# EAGLE design powermeter (EAGLE 6.6.0)
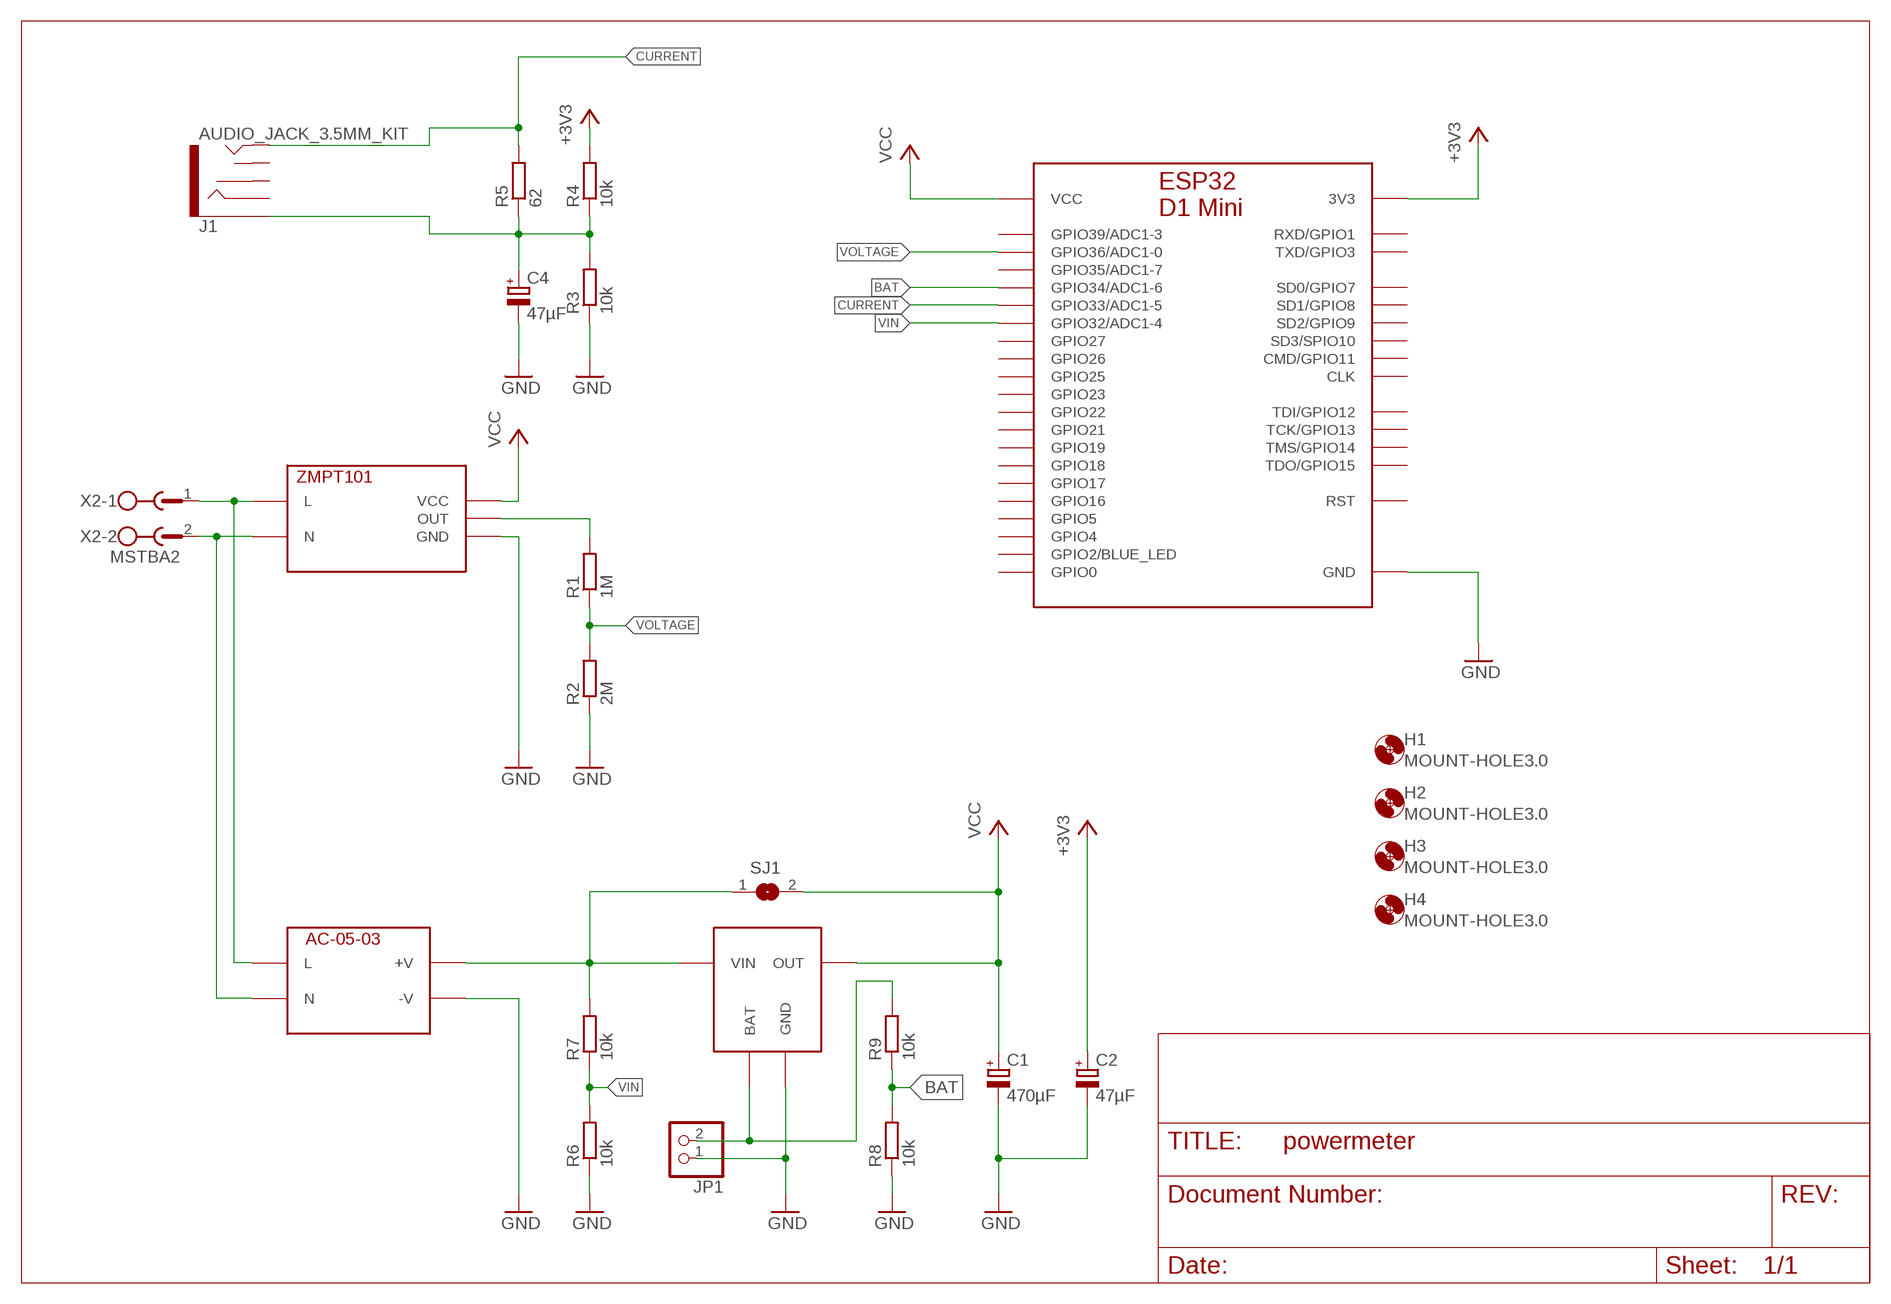
[diagram p0: schematic, sheet 1]

## Parts
C1  470µF  CPOL-EUE5-8.5  [E5-8,5]
C2  47µF  CPOL-EUE2.5-5  [E2,5-5]
C4  47µF  CPOL-EUE2.5-5  [E2,5-5]
H1  MOUNT-HOLE3.0  [3,0]
H2  MOUNT-HOLE3.0  [3,0]
H3  MOUNT-HOLE3.0  [3,0]
H4  MOUNT-HOLE3.0  [3,0]
J1  AUDIO_JACK_3.5MM_KIT  [AUDIO-JACK-KIT]
JP1  PINHD-1X2  [1X02]
R1  1M  R-EU_0204/7  [0204/7]
R2  2M  R-EU_0204/7  [0204/7]
R3  10k  R-EU_0204/7  [0204/7]
R4  10k  R-EU_0204/7  [0204/7]
R5  62  R-EU_0204/7  [0204/7]
R6  10k  R-EU_0204/7  [0204/7]
R7  10k  R-EU_0204/7  [0204/7]
R8  10k  R-EU_0204/7  [0204/7]
R9  10k  R-EU_0204/7  [0204/7]
SJ1  SJ  [SJ]
U1  ESP32D1MINI  [ESP32D1MINI]
U$1  ZMPT101  [ZMPT101]
U$2  AC-05-03  [AC-05-03]
U$3  MINI-UPS-S  [MINI-UPS-S]
X2  MSTBA2  [MSTBA2]

## Nets
+3V3 [power]: C2.+ R4.2 U1.3V3
BAT: R8.2 R9.1 U1.IO34(GPIO34/ADC1-6)
CURRENT: J1.TIP R5.2 U1.IO33(GPIO33/ADC1-5)
GND [power]: C1.- C2.- C4.- JP1.1 R2.1 R3.1 R6.1 R8.1 U1.GND1(GND) U1.GND2(GND) U1.GND3(GND) U$1.P$3(GND) U$1.P$4(GND) U$2.-V U$3.P$1(GND) U$3.P$3(GND) U$3.P$4(GND)
N$1: R1.2 U$1.OUT
N$2 [230v]: U$1.L U$2.L X2.1
N$3: C4.+ J1.SLEEVE R3.2 R4.1 R5.1
N$4 [230v]: U$1.N U$2.N X2.2
N$5: R7.2 SJ1.1 U$2.+V U$3.VIN
N$6: JP1.2 R9.2 U$3.BAT
VCC [power]: C1.+ SJ1.2 U1.VCC U$1.VCC U$3.OUT
VIN: R6.2 R7.1 U1.IO32(GPIO32/ADC1-4)
VOLTAGE: R1.1 R2.2 U1.IO36(GPIO36/ADC1-0)
Unconnected: J1.RING J1.RSH J1.TSH U1.CLK U1.CMD(CMD/GPIO11) U1.IO0(GPIO0) U1.IO2(GPIO2/BLUE_LED) U1.IO4(GPIO4) U1.IO5(GPIO5) U1.IO16(GPIO16) U1.IO17(GPIO17) U1.IO18(GPIO18) U1.IO19(GPIO19) U1.IO21(GPIO21) U1.IO22(GPIO22) U1.IO23(GPIO23) U1.IO25(GPIO25) U1.IO26(GPIO26) U1.IO27(GPIO27) U1.IO35(GPIO35/ADC1-7) U1.IO39(GPIO39/ADC1-3) U1.RST U1.RXD(RXD/GPIO1) U1.SD0(SD0/GPIO7) U1.SD1(SD1/GPIO8) U1.SD2(SD2/GPIO9) U1.SD3(SD3/SPIO10) U1.TCK(TCK/GPIO13) U1.TDI(TDI/GPIO12) U1.TDO(TDO/GPIO15) U1.TMS(TMS/GPIO14) U1.TXD(TXD/GPIO3)

## Library data of the parts
C1 C2 C4 = rcl:CPOL-EU: POLARIZED CAPACITOR, European symbol
H1-H4 = holes:MOUNT-HOLE: MOUNTING HOLE with drill center marker
J1 = SparkFun-Connectors:AUDIO_JACK_3.5MM: Audio Jack 3.5mm variants of PTH and SMT stereo audio jack with bypass switches. SparkFun Products: SparkFun SparkPunk Sound Kit <[https://www.sparkfun.com/products/11177]> - PTH MP3 Trigger <https://www.sparkfun.com/products/13720> -3.5mm SMD SparkFun PicoBoard <https://www.sparkfun.com/products/11888>- 2.5mm SMD; PROD_ID: CONN-08774; SF_ID: PRT-08032
JP1 = pinhead:PINHD-1X2: PIN HEADER
R1-R9 = rcl:R-EU_: RESISTOR, European symbol
SJ1 = jumper:SJ: SMD solder JUMPER
U1 = esp32-d1-mini:ESP32D1MINI
U$1 = ZMPT101:ZMPT101
U$2 = AC-05-03:AC-05-03
U$3 = mini-ups:MINI-UPS-S
X2 = con-phoenix-508:MSTBA2: PHOENIX; MF: FARNELL; MPN: 1757242; OC_FARNELL: 3705171; OC_NEWARK: 71C4161

## Net classes
0 default: width 0.305 mm, clearance 0.159 mm
1 power: width 0.61 mm, clearance 0.318 mm
2 230v: width 1.422 mm, clearance 1.676 mm

## Board
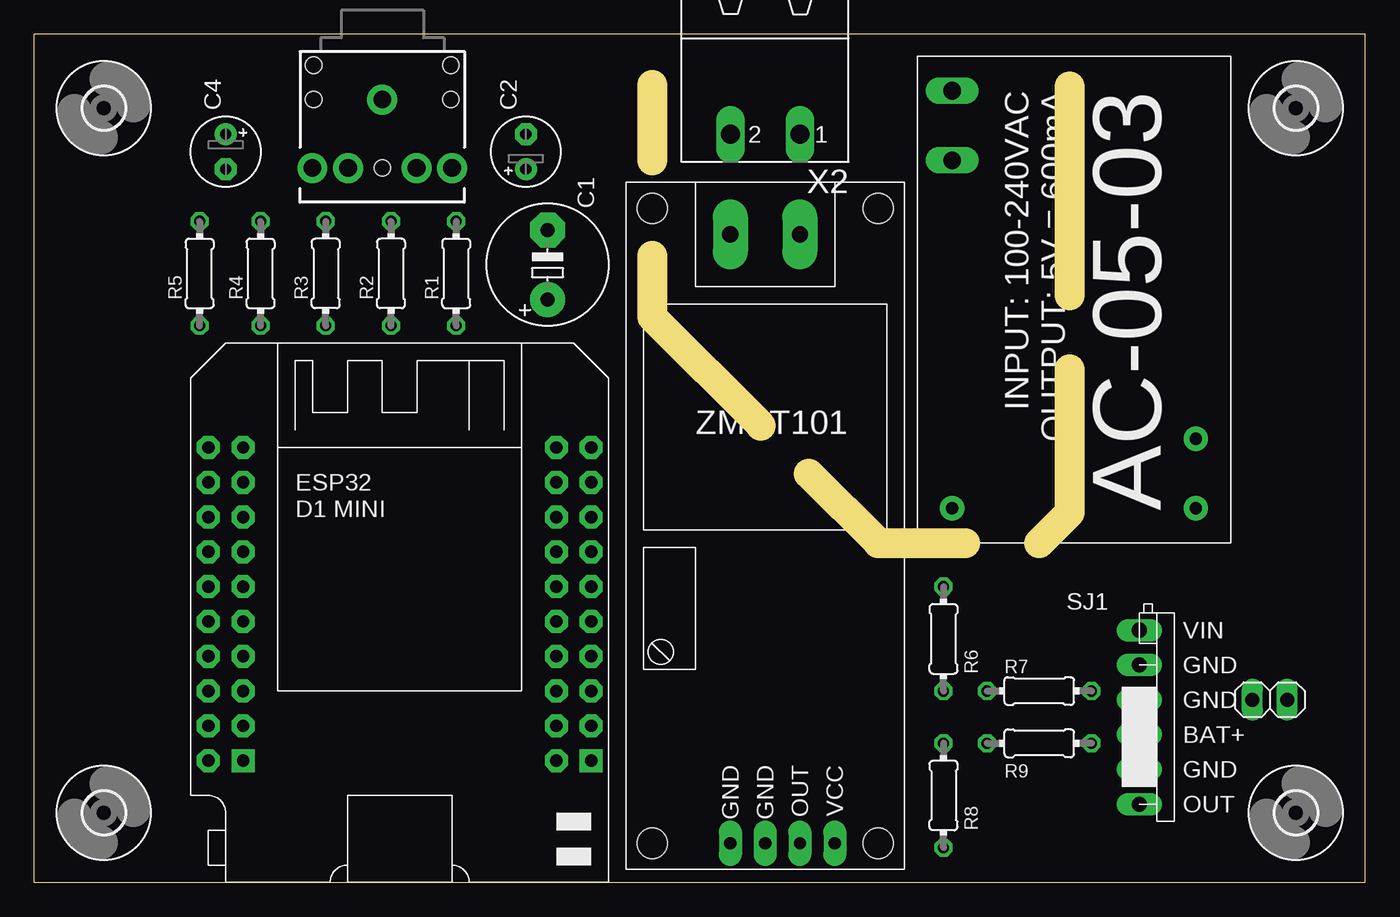
[diagram p1: board, top side]
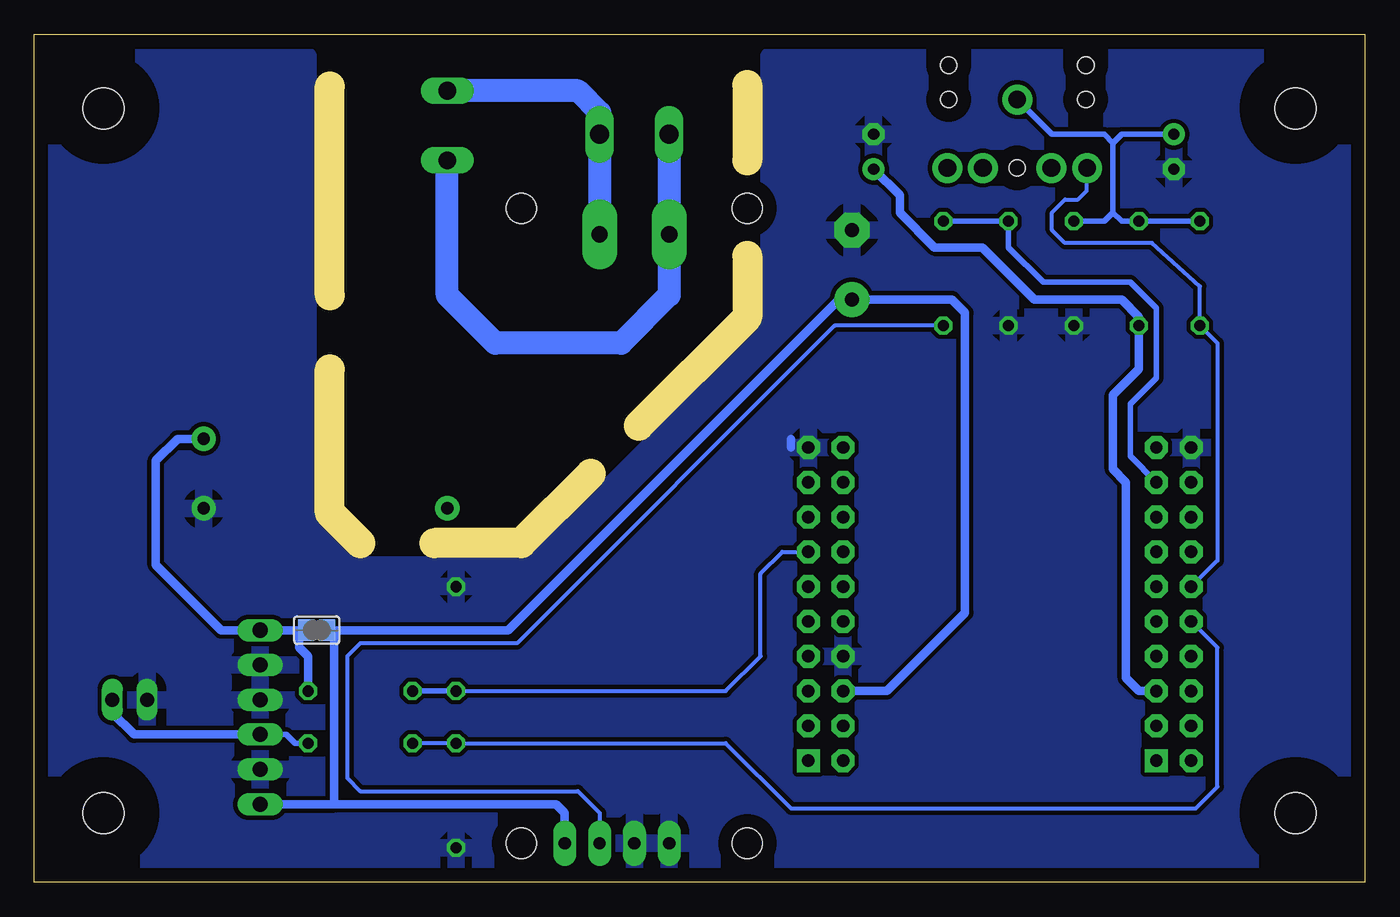
[diagram p2: board, bottom side, seen from below]

Size 97.14 x 61.91 mm. Coordinates in mm from the lower left corner, seen from the top.
Outline: 0,0 97.14,0 97.14,61.9 27.94,61.91 0.32,61.91 0,61.9 0,0
Copper layers (1*16): Top 0.035mm / dielectric 1.5mm / Bottom 0.035mm
Design rules "default *": minimum track width 10mil, minimum drill 24mil, track to track 8mil, track to pad 8mil, pad to pad 8mil, via to via 8mil, smd to smd 8mil, copper to edge 40mil, drill to drill 8mil, minimum pad ring 10mil, minimum via ring 8mil, stop-mask expansion 4mil, vias tented up to drill 0mil, thermal gap 25mil
Milling: 8 lines

### Footprints (pad centres in the part's own frame; a part is rotated, then mirrored left to right if it is on the bottom)
E5-8,5 = drill 1.016 pad 2.54: + -2.54,0 | drill 1.016 pad 2.54 octagon: - 2.54,0
E2,5-5 = drill 0.813 pad 1.6: + -1.27,0 | drill 0.813 pad 1.6 octagon: - 1.27,0
3,0 = hole 3: 0,0
AUDIO-JACK-KIT = drill 1.3 pad 2.184: RING 5,5.1; RSH 5,2.5; SLEEVE 0,0; TIP 5,-5.1; TSH 5,-2.5 | hole 1.2: 0,5; -2.5,5; -2.5,-5; 0,-5; 5,0
1X02 = drill 1.016 long: 1 -1.27,0; 2 1.27,0
0204/7 = drill 0.813 octagon: 1 -3.81,0; 2 3.81,0
SJ = smd 1.168 x 1.6: 1 -0.762,0; 2 0.762,0
ESP32D1MINI = drill 0.9 pad 1.676 octagon: 3V3 -11.43,-6.35; CMD -13.97,-11.43; GND1 11.43,-3.81; GND2 13.97,11.43; GND3 -13.97,11.43; IO0 13.97,-3.81; IO2 13.97,-6.35; IO4 13.97,-1.27; IO5 -11.43,-3.81; IO16 11.43,-1.27; IO17 11.43,1.27; IO18 -11.43,3.81; IO19 -11.43,1.27; IO21 11.43,3.81; IO22 11.43,6.35; IO23 -11.43,-1.27; IO25 13.97,6.35; IO26 -11.43,6.35; IO27 13.97,8.89; IO32 13.97,3.81; IO33 -13.97,1.27; IO34 -13.97,-1.27; IO35 -13.97,3.81; IO36 -11.43,8.89; IO39 -13.97,6.35; NC -13.97,8.89; P$13 -13.97,-6.35; RST -11.43,11.43; RXD 11.43,8.89; SD0 11.43,-11.43; SD1 13.97,-8.89; SD2 -13.97,-8.89; TCK -11.43,-8.89; TDI 13.97,1.27; TDO 11.43,-8.89; TMS -13.97,-3.81; TXD 11.43,11.43; VCC 11.43,-6.35 | drill 0.9 pad 1.676 square: CLK 13.97,-11.43; SD3 -11.43,-11.43
ZMPT101 = drill 1.2 pad 2.54 long: L -22.86,2.54; N -22.86,-2.54 | drill 0.9 pad 1.676 long: OUT 21.59,2.54; P$3 21.59,0; P$4 21.59,-2.54; VCC 21.59,5.08 | hole 2.2: -24.765,8.255; -24.765,-8.255; 21.59,-8.255; 21.59,8.255
AC-05-03 = drill 0.9 pad 1.778: +V 10.16,8.89; -V 15.24,8.89; NC 15.24,-8.89 | drill 1.3 long: L -15.24,-8.89; N -10.16,-8.89
MINI-UPS-S = drill 1.1 long: BAT 1.27,0; OUT 6.35,0; P$1 -1.27,0; P$3 -3.81,0; P$4 3.81,0; VIN -6.35,0
MSTBA2 = drill 1.397 long: 1 -2.54,5.08; 2 2.54,5.08

### Placement (x,y rotation side)
C1  37.47,45.09 90 top
C2  35.88,53.34 90 top
C4  13.97,53.34 270 top
H1  92.08,56.52 0 top
H2  92.08,5.08 0 top
H3  5.08,5.08 0 top
H4  5.08,56.52 0 top
J1  25.4,57.15 270 top
JP1  90.17,13.34 0 top
R1  30.8,44.45 270 top
R2  26.04,44.45 90 top
R3  21.27,44.45 90 top
R4  16.51,44.45 270 top
R5  12.06,44.45 270 top
R6  66.36,17.78 270 top
R7  73.34,13.97 0 top
R8  66.36,6.35 90 top
R9  73.34,10.16 0 top
SJ1  76.52,18.41 0 bottom
U1  26.67,20.32 0 top
U$1  53.34,24.45 270 top
U$2  75.88,42.55 270 top
U$3  80.64,12.06 270 top
X2  53.34,59.69 180 top

### Tracks (layer width: path | path; a pad name or v marks a point on that pad's centre or on a via)
+3V3
  Bottom 0.61: U1.3V3 16.51,13.97 17.46,14.92 17.46,29.21 18.41,30.16 18.41,35.56 16.51,37.47 R4.2 16.51,41.27 17.78,42.55 24.13,42.55 27.94,46.35 31.43,46.35 33.97,48.9 33.97,50.16 C2.+
BAT
  Bottom 0.305: R9.1 R8.2 46.67,10.16 41.91,5.4 12.38,5.4 10.79,6.99 10.79,17.14 U1.IO34
CURRENT
  Bottom 0.305: J1.TIP 20.32,50.54 20.32,50.48 20.95,49.85 21.91,49.85 22.86,48.9 22.86,47.62 21.91,46.67 15.56,46.67 12.06,43.5 R5.2 10.79,39.37 10.79,23.5 U1.IO33
GND
  Bottom 0.61: 41.91,32.38 41.91,31.75 | 51.23,3.81 U$1.P$4 51.12,3.81 | U$1.P$3 53.34,3.81 | U$3.P$3 79.69,15.88 | U$3.P$4 80.33,8.26 | R8.1 66.36,2.86
  pour Bottom: 1.27,60.33 43.5,60.33 43.5,40.64 60.96,23.18 73.98,23.18 77.15,26.35 77.15,60.33 95.89,60.33 95.89,1.27 1.27,1.27
N$1
  Bottom 0.305: R1.2 38.73,40.64 61.91,17.46 73.34,17.46 74.3,16.51 74.3,7.62 73.34,6.67 57.47,6.67 55.88,5.08 U$1.OUT
N$2
  Bottom 1.676: U$1.L X2.1 55.88,56.2 57.47,57.78 U$2.L
N$3
  Bottom 0.406: R5.1 R4.1 17.78,48.26 18.41,48.9 | J1.SLEEVE 22.86,54.61 19.05,54.61 18.41,53.98 | C4.+ 17.78,54.61 18.41,53.98 | 18.41,53.98 18.41,48.9 | R3.2 19.05,48.26 18.41,48.9
N$4
  Bottom 1.676: X2.2 U$1.N 50.8,42.86 54.29,39.37 63.5,39.37 66.99,42.86 U$2.N
N$5
  Bottom 0.61: 77.79,18.41 U$3.VIN 83.5,18.41 88.27,23.18 88.27,30.8 86.68,32.38 U$2.+V | R7.2 77.15,16.51 77.79,17.14 77.79,18.41 | 77.79,18.41 SJ1.1
N$6
  Bottom 0.406: R9.2 78.11,10.16 78.74,10.79 U$3.BAT
  Bottom 0.61: U$3.BAT 89.85,10.79 91.44,12.38 JP1.2
VCC
  Bottom 0.61: U$1.VCC 58.42,5.08 59.05,5.71 75.25,5.71 | 75.25,18.41 62.55,18.41 38.42,42.55 C1.+ 30.16,42.55 29.21,41.59 29.21,19.68 34.92,13.97 U1.VCC | U$3.OUT 75.25,5.71 | 75.25,5.71 75.25,18.41 | SJ1.2 75.25,18.41
VIN
  Bottom 0.305: R7.1 46.67,13.97 44.13,16.51 44.13,22.54 42.55,24.13 U1.IO32
  Bottom 0.406: R6.2 R7.1
VOLTAGE
  Bottom 0.406: R1.1 R2.2 26.04,46.35 23.5,43.81 17.14,43.81 15.24,41.91 15.24,36.83 17.14,34.92 17.14,31.11 U1.IO36